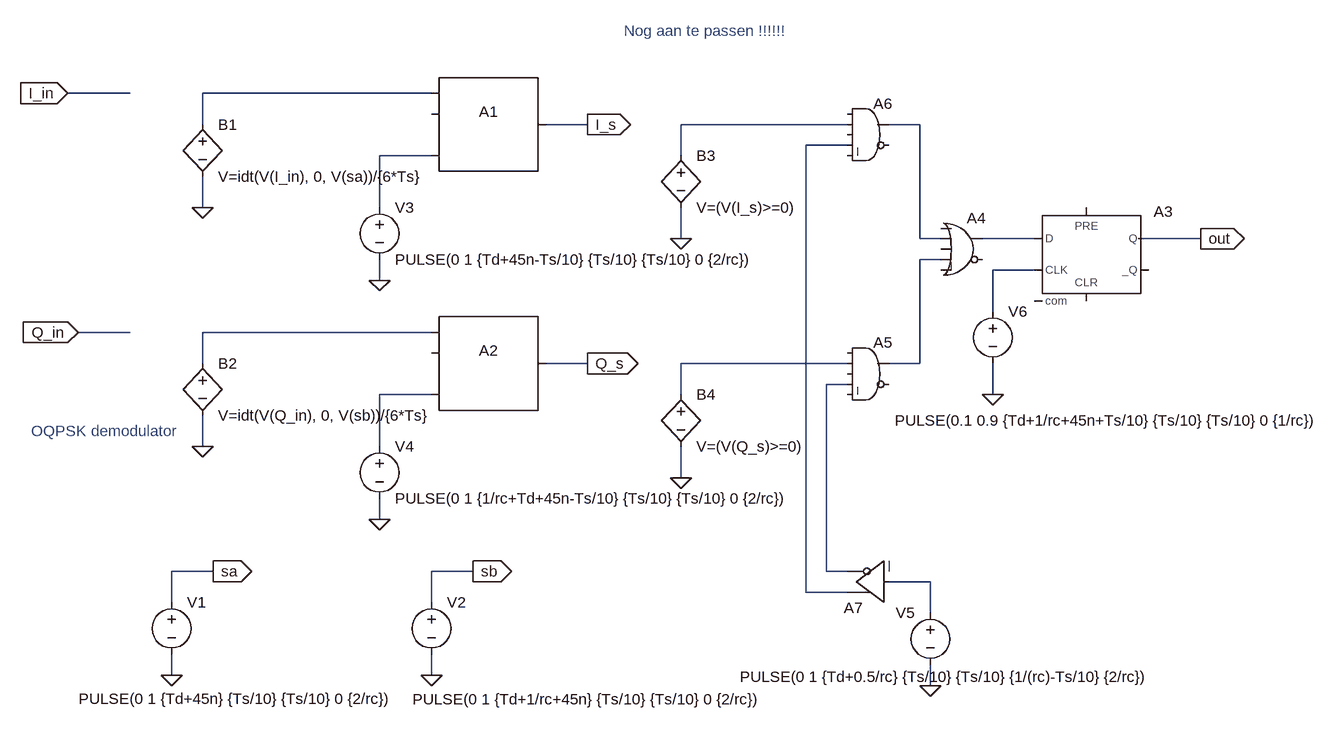
[diagram p0: schematic par_to_serial.asc]
par_to_serial.asc, the LTspice schematic file:
Version 4
SHEET 1 1944 996
WIRE 32 16 -64 16
WIRE 32 384 -48 384
WIRE 96 800 96 752
WIRE 96 912 96 880
WIRE 144 64 144 16
WIRE 144 192 144 144
WIRE 144 432 144 384
WIRE 144 560 144 512
WIRE 160 752 96 752
WIRE 416 192 416 112
WIRE 416 304 416 272
WIRE 416 560 416 480
WIRE 416 672 416 640
WIRE 496 16 144 16
WIRE 496 112 416 112
WIRE 496 384 144 384
WIRE 496 480 416 480
WIRE 496 800 496 752
WIRE 496 912 496 880
WIRE 560 752 496 752
WIRE 736 64 672 64
WIRE 736 432 672 432
WIRE 880 112 880 64
WIRE 880 240 880 192
WIRE 880 480 880 432
WIRE 880 608 880 560
WIRE 1072 784 1072 96
WIRE 1104 752 1104 464
WIRE 1136 64 880 64
WIRE 1136 96 1072 96
WIRE 1136 432 880 432
WIRE 1136 464 1104 464
WIRE 1136 752 1104 752
WIRE 1136 784 1072 784
WIRE 1248 64 1200 64
WIRE 1248 240 1248 64
WIRE 1248 432 1200 432
WIRE 1248 432 1248 272
WIRE 1264 768 1200 768
WIRE 1264 816 1264 768
WIRE 1264 928 1264 896
WIRE 1280 240 1248 240
WIRE 1280 272 1248 272
WIRE 1360 352 1360 288
WIRE 1360 480 1360 432
WIRE 1424 240 1344 240
WIRE 1424 288 1360 288
WIRE 1680 240 1584 240
FLAG -64 16 I_in
IOPIN -64 16 In
FLAG -48 384 Q_in
IOPIN -48 384 In
FLAG 144 192 0
FLAG 144 560 0
FLAG 736 432 Q_s
IOPIN 736 432 Out
FLAG 96 912 0
FLAG 160 752 sa
IOPIN 160 752 Out
FLAG 496 912 0
FLAG 560 752 sb
IOPIN 560 752 Out
FLAG 880 240 0
FLAG 880 608 0
FLAG 736 64 I_s
IOPIN 736 64 Out
FLAG 416 304 0
FLAG 416 672 0
FLAG 1264 928 0
FLAG 1680 240 out
IOPIN 1680 240 Out
FLAG 1360 480 0
SYMBOL bv 144 48 R0
SYMATTR InstName B1
SYMATTR Value V=idt(V(I_in), 0, V(sa))/{6*Ts}
SYMBOL bv 144 416 R0
SYMATTR InstName B2
SYMATTR Value V=idt(V(Q_in), 0, V(sb))/{6*Ts}
SYMBOL voltage 96 784 R0
WINDOW 123 0 0 Left 0
WINDOW 39 0 0 Left 0
WINDOW 3 -143 164 Left 0
SYMATTR Value PULSE(0 1 {Td+45n} {Ts/10} {Ts/10} 0 {2/rc})
SYMATTR InstName V1
SYMBOL voltage 496 784 R0
WINDOW 123 0 0 Left 0
WINDOW 39 0 0 Left 0
WINDOW 3 -29 165 Left 0
SYMATTR Value PULSE(0 1 {Td+1/rc+45n} {Ts/10} {Ts/10} 0 {2/rc})
SYMATTR InstName V2
SYMBOL bv 880 96 R0
SYMATTR InstName B3
SYMATTR Value V=(V(I_s)>=0)
SYMBOL bv 880 464 R0
SYMATTR InstName B4
SYMATTR Value V=(V(Q_s)>=0)
SYMBOL SpecialFunctions\\sample 576 48 R0
SYMATTR InstName A1
SYMBOL voltage 416 176 R0
WINDOW 123 0 0 Left 0
WINDOW 39 0 0 Left 0
SYMATTR InstName V3
SYMATTR Value PULSE(0 1 {Td+45n-Ts/10} {Ts/10} {Ts/10} 0 {2/rc})
SYMBOL SpecialFunctions\\sample 576 416 R0
SYMATTR InstName A2
SYMBOL voltage 416 544 R0
WINDOW 123 0 0 Left 0
WINDOW 39 0 0 Left 0
SYMATTR InstName V4
SYMATTR Value PULSE(0 1 {1/rc+Td+45n-Ts/10} {Ts/10} {Ts/10} 0 {2/rc})
SYMBOL voltage 1264 800 M0
WINDOW 123 0 0 Left 0
WINDOW 39 0 0 Left 0
WINDOW 3 -343 114 Left 0
SYMATTR Value PULSE(0 1 {Td+0.5/rc} {Ts/10} {Ts/10} {1/(rc)-Ts/10} {2/rc})
SYMATTR InstName V5
SYMBOL Digital\\buf 1200 832 R180
SYMATTR InstName A7
SYMBOL Digital\\dflop 1504 192 R0
SYMATTR InstName A3
SYMBOL Digital\\or 1312 192 R0
SYMATTR InstName A4
SYMBOL Digital\\and 1168 16 R0
SYMATTR InstName A6
SYMBOL Digital\\and 1168 384 R0
SYMATTR InstName A5
SYMBOL voltage 1360 336 R0
WINDOW 3 -151 184 Left 0
WINDOW 123 0 0 Left 0
WINDOW 39 0 0 Left 0
SYMATTR Value PULSE(0.1 0.9 {Td+1/rc+45n+Ts/10} {Ts/10} {Ts/10} 0 {1/rc})
SYMATTR InstName V6
TEXT -120 536 Left 0 ;OQPSK demodulator
TEXT 792 -80 Left 0 ;Nog aan te passen !!!!!!

The netlist it stands for:
* par_to_serial.asc
B1 N001 0 V=idt(V(I_in), 0, V(sa))/{6*Ts}
B2 N002 0 V=idt(V(Q_in), 0, V(sb))/{6*Ts}
V1 sa 0 PULSE(0 1 {Td+45n} {Ts/10} {Ts/10} 0 {2/rc})
V2 sb 0 PULSE(0 1 {Td+1/rc+45n} {Ts/10} {Ts/10} 0 {2/rc})
B3 N005 0 V=(V(I_s)>=0)
B4 N006 0 V=(V(Q_s)>=0)
A1 N001 0 0 N003 0 0 I_s 0 SAMPLEHOLD
V3 N003 0 PULSE(0 1 {Td+45n-Ts/10} {Ts/10} {Ts/10} 0 {2/rc})
A2 N002 0 0 N004 0 0 Q_s 0 SAMPLEHOLD
V4 N004 0 PULSE(0 1 {1/rc+Td+45n-Ts/10} {Ts/10} {Ts/10} 0 {2/rc})
V5 N011 0 PULSE(0 1 {Td+0.5/rc} {Ts/10} {Ts/10} {1/(rc)-Ts/10} {2/rc})
A7 N011 0 0 0 0 N008 N007 0 BUF
A3 N013 0 N012 0 0 0 out 0 DFLOP
A4 0 N009 0 N010 0 0 N013 0 OR
A6 0 N005 0 N007 0 0 N009 0 AND
A5 0 N006 0 N008 0 0 N010 0 AND
V6 N012 0 PULSE(0.1 0.9 {Td+1/rc+45n+Ts/10} {Ts/10} {Ts/10} 0 {1/rc})
* OQPSK demodulator
* Nog aan te passen !!!!!!
.backanno
.end